# EAGLE design Zio Eink Display Red 2.9 (EAGLE 8.6.1)
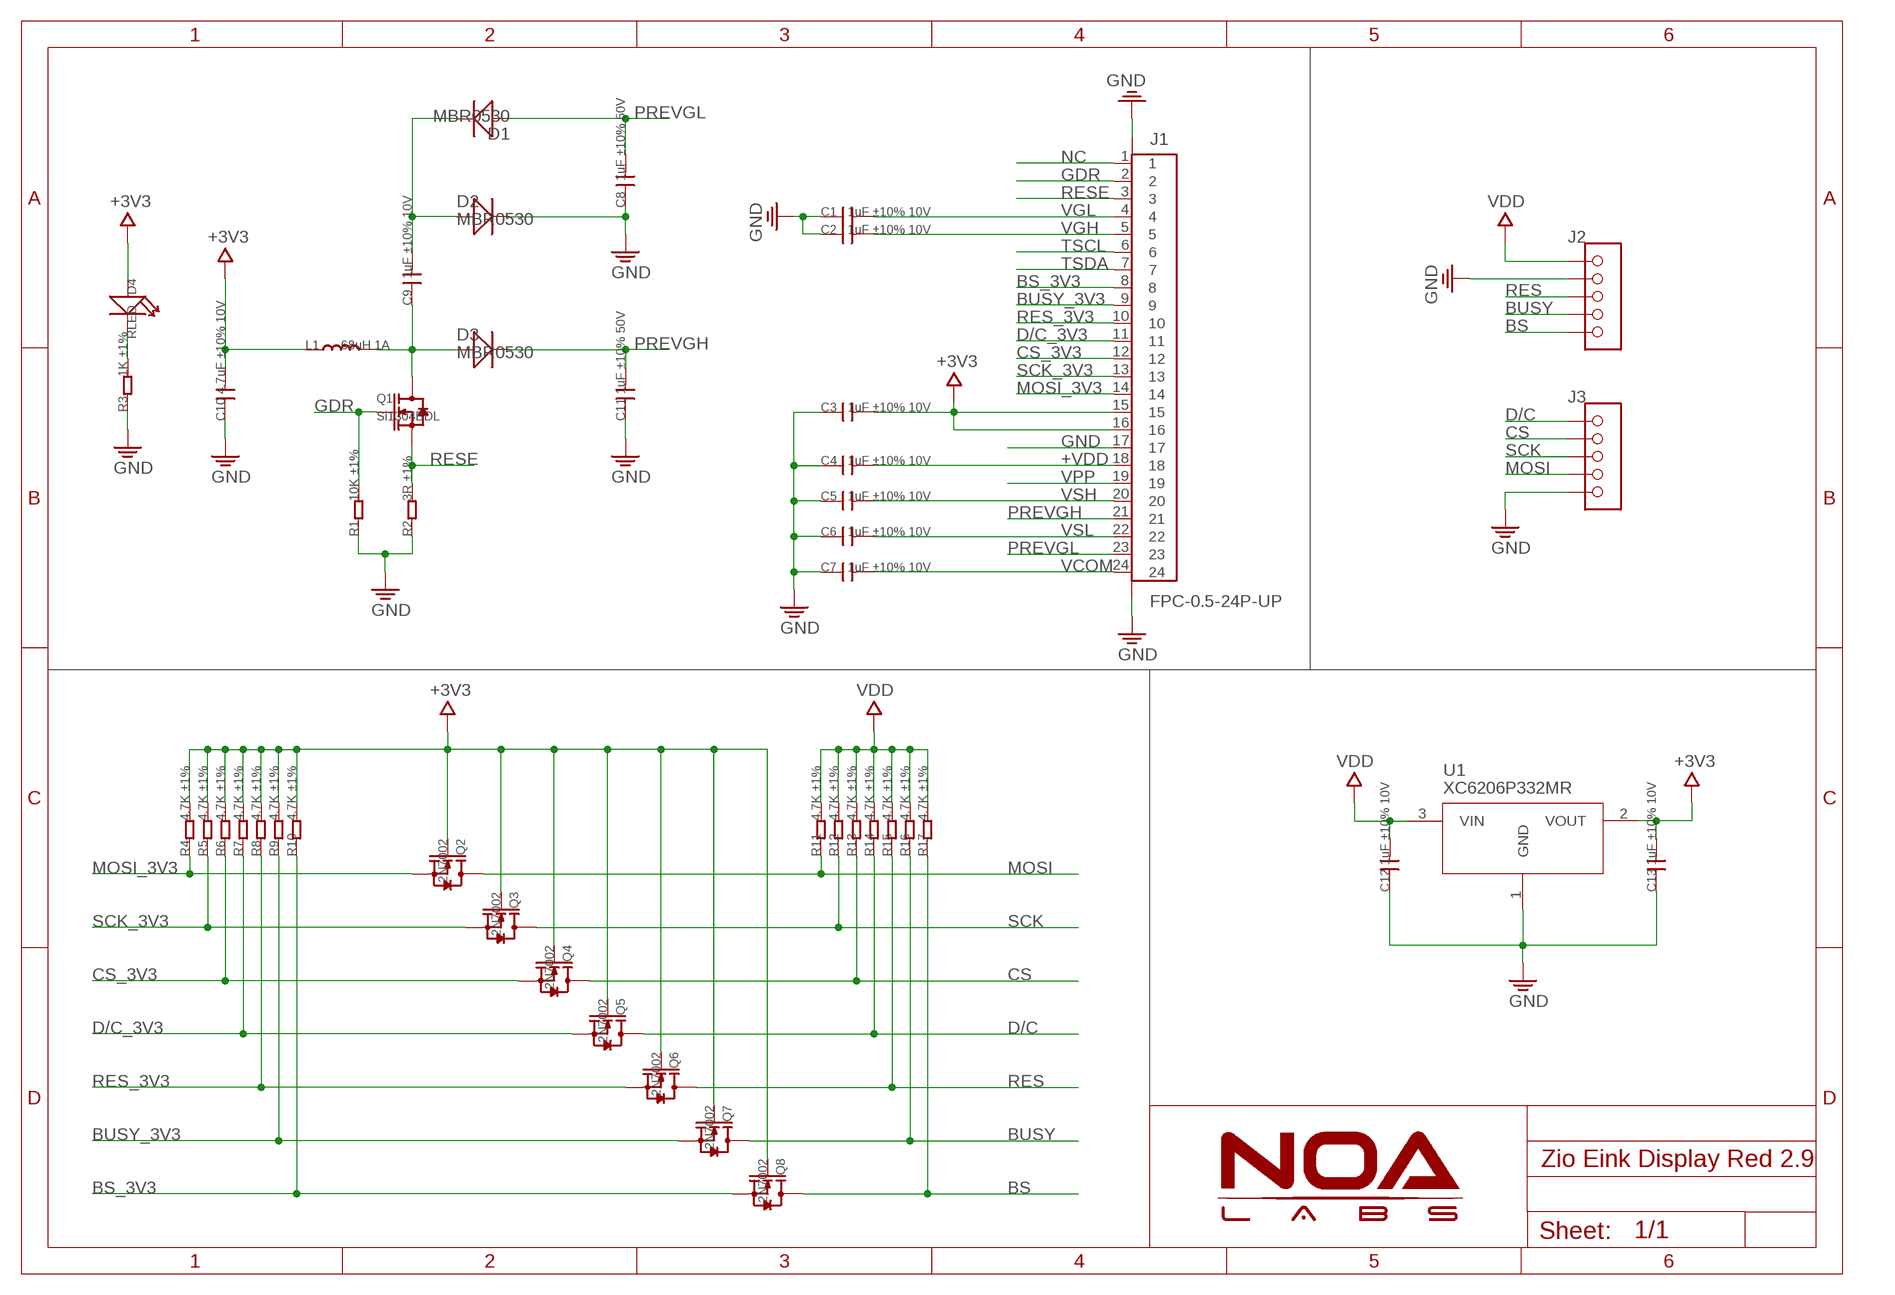
[diagram p0: schematic, sheet 1]

## Parts
C1  1uF ±10% 10V  C-0603  [0603]
C2  1uF ±10% 10V  C-0603  [0603]
C3  1uF ±10% 10V  C-0603  [0603]
C4  1uF ±10% 10V  C-0603  [0603]
C5  1uF ±10% 10V  C-0603  [0603]
C6  1uF ±10% 10V  C-0603  [0603]
C7  1uF ±10% 10V  C-0603  [0603]
C8  1uF ±10% 50V  C-0603  [0603]
C9  1uF ±10% 10V  C-0603  [0603]
C10  4.7uF ±10% 10V  C-0603  [0603]
C11  1uF ±10% 50V  C-0603  [0603]
C12  1uF ±10% 10V  C-0603  [0603]
C13  1uF ±10% 10V  C-0603  [0603]
D1  MBR0530  D'1206'  [SOD123]
D2  MBR0530  D'1206'  [SOD123]
D3  MBR0530  D'1206'  [SOD123]
D4  RLED  LED'0603'  [LED-0603]
J1  FPC-0.5-24P-UP  [FPC-0.5-24P_UP]
J2  HEADER-5P-2.54  [5P-2.54]
J3  HEADER-5P-2.54  [5P-2.54]
L1  68uH 1A  L  [L3012]
Q1  Si1304BDL  MOSFET-N-323  [SOT-323]
Q2  2N7002  MOSFET-N-SOT23  [SOT23]
Q3  2N7002  MOSFET-N-SOT23  [SOT23]
Q4  2N7002  MOSFET-N-SOT23  [SOT23]
Q5  2N7002  MOSFET-N-SOT23  [SOT23]
Q6  2N7002  MOSFET-N-SOT23  [SOT23]
Q7  2N7002  MOSFET-N-SOT23  [SOT23]
Q8  2N7002  MOSFET-N-SOT23  [SOT23]
R1  10K ±1%  R-0603  [0603]
R2  3R ±1%  R-0603  [0603]
R3  1K ±1%  R-0603  [0603]
R4  4.7K ±1%  R-0603  [0603]
R5  4.7K ±1%  R-0603  [0603]
R6  4.7K ±1%  R-0603  [0603]
R7  4.7K ±1%  R-0603  [0603]
R8  4.7K ±1%  R-0603  [0603]
R9  4.7K ±1%  R-0603  [0603]
R10  4.7K ±1%  R-0603  [0603]
R11  4.7K ±1%  R-0603  [0603]
R12  4.7K ±1%  R-0603  [0603]
R13  4.7K ±1%  R-0603  [0603]
R14  4.7K ±1%  R-0603  [0603]
R15  4.7K ±1%  R-0603  [0603]
R16  4.7K ±1%  R-0603  [0603]
R17  4.7K ±1%  R-0603  [0603]
U1  XC6206P332MR  XC6206MR  [SOT23]

## Nets
+3V3: C3.2 C10.2 C13.2 D4.+ J1.15 J1.16 L1.P$1 Q2.1(G) Q3.1(G) Q4.1(G) Q5.1(G) Q6.1(G) Q7.1(G) Q8.1(G) R4.2 R5.2 R6.2 R7.2 R8.2 R9.2 R10.2 U1.2(VOUT)
+VDD: C4.2 J1.18
BS: J2.5 Q8.3(D) R17.1
BS_3V3: J1.8 Q8.2(S) R10.1
BUSY: J2.4 Q7.3(D) R16.1
BUSY_3V3: J1.9 Q7.2(S) R9.1
CS: J3.2 Q4.3(D) R13.1
CS_3V3: J1.12 Q4.2(S) R6.1
D/C: J3.1 Q5.3(D) R14.1
D/C_3V3: J1.11 Q5.2(S) R7.1
GDR: J1.2 Q1.1(G) R1.2
GND: C1.1 C2.1 C3.1 C4.1 C5.1 C6.1 C7.1 C8.1 C10.1 C11.1 C12.1 C13.1 D2.- J1.17 J1.25(G1) J1.26(G2) J2.2 J3.5 R1.1 R2.1 R3.1 U1.1(GND)
MOSI: J3.4 Q2.3(D) R11.1
MOSI_3V3: J1.14 Q2.2(S) R4.1
N$2: C9.2 D1.- D2.+
N$3: C9.1 D3.+ L1.P$2 Q1.3(D)
N$7: D4.- R3.2
NC: J1.1
PREVGH: C11.2 D3.- J1.21
PREVGL: C8.2 D1.+ J1.23
RES: J2.3 Q6.3(D) R15.1
RES_3V3: J1.10 Q6.2(S) R8.1
RESE: J1.3 Q1.2(S) R2.2
SCK: J3.3 Q3.3(D) R12.1
SCK_3V3: J1.13 Q3.2(S) R5.1
TSCL: J1.6
TSDA: J1.7
VCOM: C7.2 J1.24
VDD: C12.2 J2.1 R11.2 R12.2 R13.2 R14.2 R15.2 R16.2 R17.2 U1.3(VIN)
VGH: C2.2 J1.5
VGL: C1.2 J1.4
VPP: J1.19
VSH: C5.2 J1.20
VSL: C6.2 J1.22

## Library data of the parts
C1-C13 = Discretex:C*: Ceramic Capacitors
D1-D3 = Discretex:D*
D4 = Discretex:LED*
J1 = Connector:FPC-0.5-24P
J2 J3 = Connector:HEADER-5P
L1 = Discretex:L*
Q1-Q8 = Discretex:MOSFET-N
R1-R17 = Discretex:R*
U1 = IC:XC6206MR

## Board
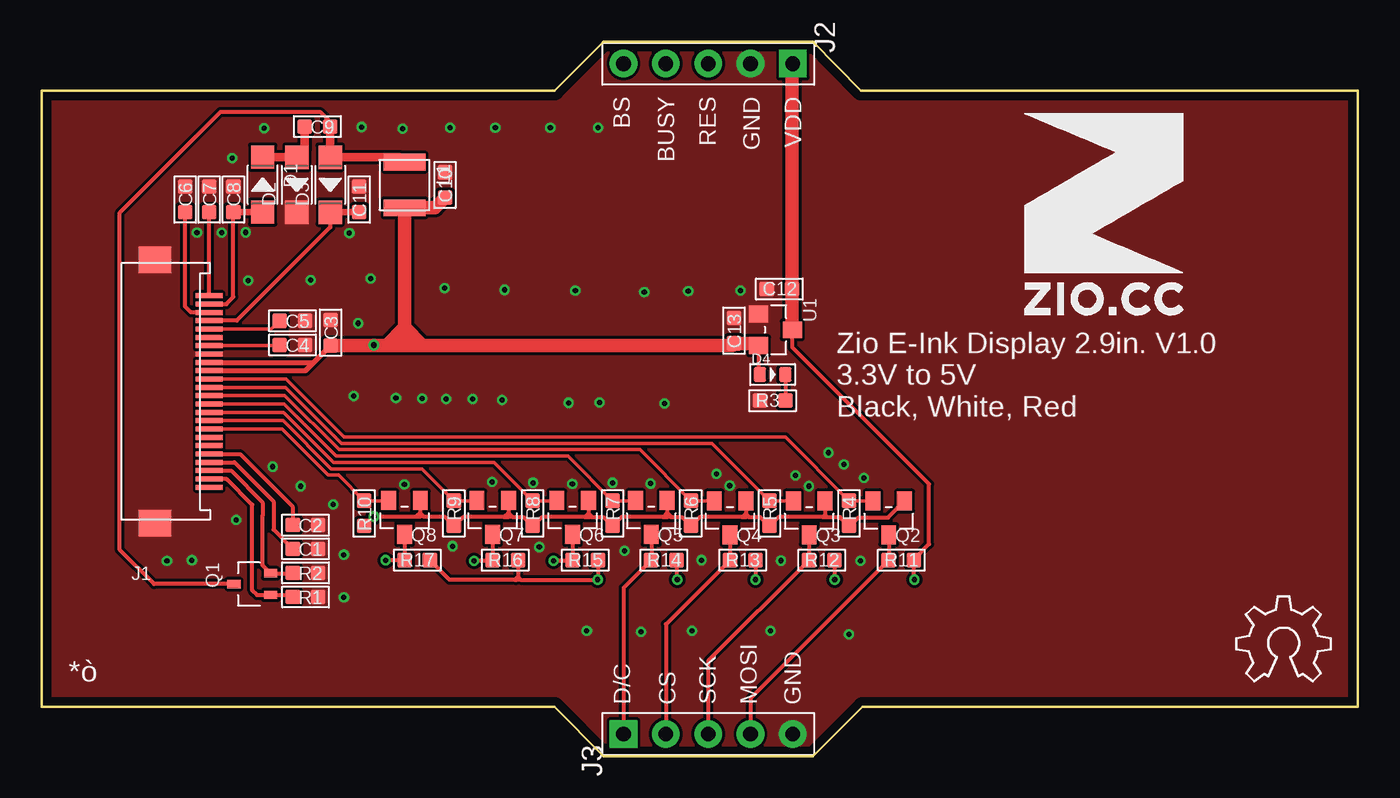
[diagram p1: board, top side]
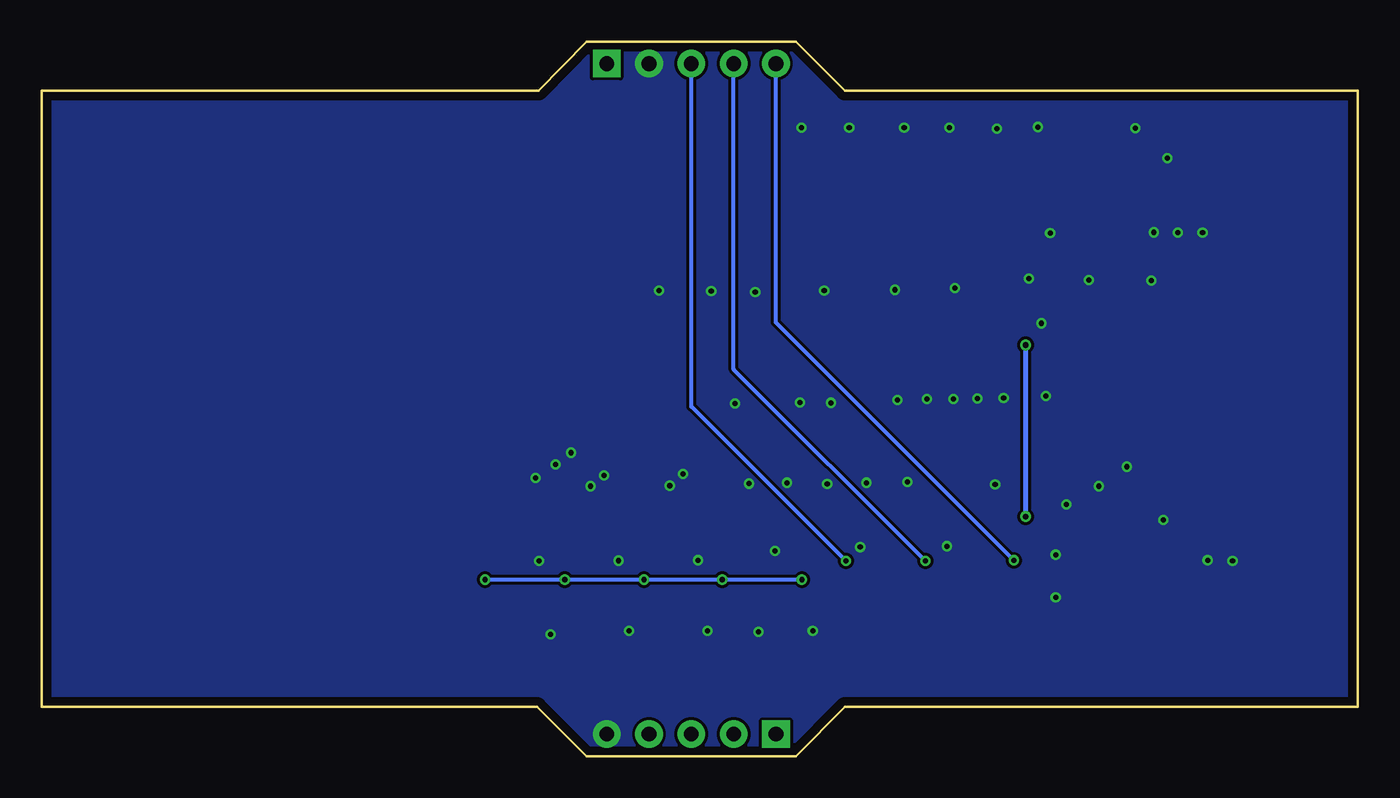
[diagram p2: board, bottom side, seen from below]

Size 79 x 42.89 mm. Coordinates in mm from the lower left corner, seen from the top.
Outline: 0,2.95 30.79,2.95 33.73,0 46.3,0 49.25,2.95 79,2.95 79,39.95 49.17,39.95 46.3,42.89 33.73,42.89 30.79,39.95 0,39.95 0,2.95
Copper layers (1*16): Top 0.035mm / dielectric 1.5mm / Bottom 0.035mm
Design rules "NOA Eagle Rule": minimum track width 7mil, minimum drill 12mil, track to track 7mil, track to pad 7mil, pad to pad 7mil, via to via 7mil, smd to smd 0mil, copper to edge 20mil, drill to drill 10mil, minimum pad ring 10mil, minimum via ring 6mil, stop-mask expansion 2mil, vias tented up to drill 25mil, thermal gap 10mil

### Footprints (pad centres in the part's own frame; a part is rotated, then mirrored left to right if it is on the bottom)
0603 = smd 0.889 x 0.889: 1 -0.762,0; 2 0.762,0
SOD123 = smd 1.397 x 1.397: + 1.651,0; - -1.651,0
LED-0603 = smd 0.762 x 0.889: + -0.762,0; - 0.762,0
FPC-0.5-24P_UP = smd 0.3 x 1.6: 1 -5.75,-0.05; 2 -5.25,-0.05; 3 -4.75,-0.05; 4 -4.25,-0.05; 5 -3.75,-0.05; 6 -3.25,-0.05; 7 -2.75,-0.05; 8 -2.25,-0.05; 9 -1.75,-0.05; 10 -1.25,-0.05; 11 -0.75,-0.05; 12 -0.25,-0.05; 13 0.25,-0.05; 14 0.75,-0.05; 15 1.25,-0.05; 16 1.75,-0.05; 17 2.25,-0.05; 18 2.75,-0.05; 19 3.25,-0.05; 20 3.75,-0.05; 21 4.25,-0.05; 22 4.75,-0.05; 23 5.25,-0.05; 24 5.75,-0.05 | smd 1.6 x 1.95: 25 7.9,3.2; 26 -7.9,3.2
5P-2.54 = drill 0.889 pad 1.651 square: 1 0,5.08 | drill 0.889 pad 1.651: 2 0,2.54; 3 0,0; 4 0,-2.54; 5 0,-5.08
L3012 = smd 2.5 x 1: P$1 0,1.373; P$2 0,-1.373
SOT-323 = smd 0.5 x 0.8: 1 0.65,0; 2 -0.65,0; 3 0,-2.2
SOT23 = smd 0.889 x 1.143: 1 -0.95,-1.016; 2 0.95,-1.016; 3 0,1.016
SOT23' = smd 1.016 x 1.143: 1 -0.95,-1.016; 2 0.95,-1.016; 3 0,1.016

### Placement (x,y rotation side)
C1  15.84,12.44 180 top
C2  15.84,13.87 180 top
C3  17.35,25.42 270 top
C4  15.05,24.69 180 top
C5  15.05,26.14 180 top
C6  8.61,33.42 270 top
C7  10.06,33.42 270 top
C8  11.51,33.42 270 top
C9  16.55,37.79 180 top
C10  24.21,34.28 270 top
C11  19.05,33.42 270 top
C12  44.28,28.04 0 top
C13  41.56,25.54 270 top
D1  13.26,34.31 270 top
D2  15.31,34.3 90 top
D3  17.32,34.3 90 top
D4  43.88,22.91 0 top
J1  10,21.89 90 top
J2  40.01,41.57 270 top
J3  40.01,1.32 90 top
L1  21.78,34.29 180 top
Q1  13.74,10.33 270 top
Q2  50.84,14.3 180 top
Q3  46.07,14.3 180 top
Q4  41.32,14.3 180 top
Q5  36.59,14.32 180 top
Q6  31.87,14.32 180 top
Q7  27.07,14.32 180 top
Q8  21.78,14.32 180 top
R1  15.84,9.55 180 top
R2  15.84,11 180 top
R3  43.88,21.34 0 top
R4  48.46,14.57 270 top
R5  43.69,14.57 270 top
R6  38.96,14.57 270 top
R7  34.27,14.57 270 top
R8  29.47,14.57 270 top
R9  24.74,14.57 270 top
R10  19.36,14.57 270 top
R11  51.6,11.76 0 top
R12  46.82,11.76 0 top
R13  42.07,11.76 0 top
R14  37.35,11.76 0 top
R15  32.62,11.76 0 top
R16  27.82,11.76 0 top
R17  22.54,11.76 0 top
U1  XC6206P332MR  [SOT23']  44.04,25.59 270 top
U$9  [12MM]  58.88,26.42 0 top
U$10  [OSHW_6X200_NOTEXT]  71.7,4.5 0 top

### Tracks (layer width: path | path; a pad name or v marks a point on that pad's centre or on a via)
+3V3  (via drill 0.35)
  Top 0.254: 22.48,14.38 22.71,14.38 | 22.48,14.38 v19.94,14.38 19.93,14.38 R10.2 | 22.94,14.38 22.71,14.38 | 22.94,14.38 24.17,14.38 R9.2 24.75,13.81 25.3,14.35 27.76,14.35 | 27.76,14.35 28.02,14.35 | 28.27,14.35 28.02,14.35 | 28.27,14.35 28.92,14.35 R8.2 29.5,13.81 30.05,14.35 32.61,14.35 | 32.61,14.35 32.87,14.35 | 33.02,14.35 32.87,14.35 | 33.02,14.35 33.72,14.35 R7.2 34.8,14.35 37.31,14.35 | 37.31,14.35 37.54,14.35 | 37.8,14.35 37.54,14.35 | 37.8,14.35 38.42,14.35 R6.2 39.51,14.35 42.06,14.35 | 42.06,14.35 42.27,14.35 | 42.44,14.35 42.27,14.35 | 42.44,14.35 43.13,14.35 43.67,13.81 R5.2 44.23,14.35 46.89,14.35 | 46.89,14.35 47.02,14.35 | 47.14,14.35 47.02,14.35 | 47.14,14.35 47.93,14.35 47.93,14.34 R4.2 48.5,13.81 49.02,14.33 50.8,14.33 Q2.1 51.79,15.49 | Q3.1 47.02,14.48 | 47.02,14.48 47.02,14.35 | 47.02,14.48 46.89,14.35 | 47.02,14.48 | 47.02,14.48 47.14,14.35 | Q4.1 42.27,14.55 | 42.27,14.53 42.27,14.35 | 42.27,14.35 | 42.27,14.55 42.06,14.35 | 42.27,14.55 42.27,14.53 | 42.27,14.53 42.44,14.35 | Q5.1 37.54,14.55 | 37.54,14.55 37.54,14.35 | 37.54,14.35 | 37.54,14.55 37.52,14.55 37.31,14.35 | 37.54,14.55 37.59,14.55 37.8,14.35 | Q6.1 32.82,14.55 | 32.82,14.55 32.82,14.4 32.87,14.35 | 32.82,14.55 32.61,14.35 | 32.82,14.55 33.02,14.35 | Q7.1 | Q7.1 28.02,14.61 | 28.02,14.61 28.02,14.35 | 28.02,14.61 27.76,14.35 | 28.02,14.61 28.27,14.35 | Q8.1 22.71,15.31 22.71,14.61 | 22.71,14.61 22.71,14.38 | 22.71,14.61 22.48,14.38 | 22.71,14.61 22.94,14.38 | U1.2 43.03,23 D4.+ | 41.63,24.7 C13.2
  Top 0.305: v19.94,24.68 20.67,24.68 20.69,24.65 | C3.2 16.33,23.64 | J1.16 16.33,23.64 | J1.15 15.83,23.14 16.33,23.64
  Top 0.813: C10.2 23.61,32.92 L1.P$1 21.78,25.75 | U1.2 42.89,24.78 C13.2 41.43,24.65 22.88,24.65 | 20.69,24.65 21.78,25.75 | C3.2 20.69,24.65 | 22.88,24.65 21.95,24.65 | 21.95,24.65 20.69,24.65 | 21.78,25.75 21.78,24.82 21.95,24.65 | 21.78,25.75 22.88,24.65
  Bottom 0.305: v19.94,14.38 v19.94,24.68
+VDD
  Top 0.203: C4.2 14.24,24.64 J1.18
BS  (via drill 0.3)
  Top 0.254: Q8.3 R17.1 v20.65,11.76
  Bottom 0.254: v20.65,11.76 34.92,26.04 J2.5
BS_3V3
  Top 0.203: Q8.2 R10.1 17.82,16.87 17.21,16.87 14.44,19.64 J1.8
BUSY  (via drill 0.3)
  Top 0.254: Q7.3 R16.1 27.01,11.71 v25.96,11.71
  Bottom 0.254: v25.96,11.71 37.47,23.22 J2.4
BUSY_3V3
  Top 0.203: Q7.2 26.11,15.33 R9.1 22.82,17.25 17.37,17.25 14.48,20.14 J1.9
CS
  Top 0.254: Q4.3 R13.1 37.47,7.92 J3.2
CS_3V3
  Top 0.203: Q4.2 40.35,15.33 R6.1 35.9,18.39 17.84,18.39 14.6,21.64 J1.12
D/C
  Top 0.254: Q5.3 R14.1 34.92,10.1 J3.1
D/C_3V3
  Top 0.203: Q5.2 R7.1 31.58,18.01 17.68,18.01 14.56,21.14 J1.11
GDR
  Top 0.254: R1.2 14.95,9.68 Q1.1 12.93,9.68 12.65,9.96 12.65,15.09 11.1,16.64 J1.2
GND  (via drill 0.3)
  other vias: 39.6,11.76 44.37,11.73 49.15,11.71 27.03,16.46 31.85,16.33 36.55,16.36 41.3,16.23 46.05,16.21 49.35,16.69 10.79,31.42 11.43,35.89 48.16,17.5 47.22,18.21 45.24,16.84 40.51,16.94 34.26,16.41 29.49,16.41 21.77,16.31 12.24,31.45 9.32,31.42 18.47,31.39 19,25.98 18.72,21.62 9.02,11.76 11.68,14.17 21.26,21.49 22.83,21.46 24.28,21.44 25.86,21.44 27.64,21.39 31.62,21.21 33.48,21.23 37.39,21.16 24.18,28.09 27.79,27.99 32.03,27.94 36.17,27.86 38.81,27.91 41.94,27.94 12.4,28.55 16.15,28.57 19.74,28.68 13.36,37.69 19.2,37.77 21.67,37.67 24.51,37.72 27.23,37.72 30.53,37.72 33.4,37.72 7.52,11.71 13.87,17.37 15.54,16.21 17.5,15.11 18.14,12.09 18.14,9.53 32.72,7.52 35.97,7.47 39.04,7.52 43.74,7.52 48.46,7.32 34.98,12.32 29.87,12.55 24.66,12.6
  pour Bottom (no thermals): 0,0 0,42.8 78.97,42.8 78.97,0
  pour Top (no thermals): 0,0 78.97,0 78.97,42.8 0,42.8
MOSI
  Top 0.254: Q2.3 R11.1 42.55,3.47 J3.4
MOSI_3V3
  Top 0.203: Q2.2 49.87,15.33 R4.1 44.64,19.16 18.16,19.16 14.68,22.64 J1.14
N$2
  Top 0.508: D1.- D2.+ 15.79,36.42 C9.2
N$3
  Top 0.254: Q1.3 6.74,10.33 4.7,12.37 4.7,32.64 10.74,38.68 16.71,38.68 17.32,38.08 17.32,37.78
  Top 0.508: C9.1 17.32,37.78 D3.+ 21.49,35.95 L1.P$2
N$7
  Top 0.254: D4.- R3.2
PREVGH
  Top 0.254: D3.- 17.32,31.75 11.71,26.14 J1.21 | C11.2
  Top 0.381: D3.- C11.2
PREVGL
  Top 0.254: C8.2 11.51,27.56 11.08,27.14 J1.23
  Top 0.381: C8.2 D1.+
RES  (via drill 0.3)
  Top 0.254: Q6.3 R15.1 31.81,11.71 v30.73,11.71
  Bottom 0.254: v30.73,11.71 40.01,20.98 J2.3
RES_3V3
  Top 0.203: Q6.2 30.91,15.33 R8.1 27.16,17.63 17.52,17.63 14.52,20.64 J1.10
RESE
  Top 0.254: R2.2 15.06,10.98 Q1.2 13.26,11.46 13.26,14.22 13.26,14.43 13.26,15.24 11.36,17.14 J1.3
SCK
  Top 0.254: Q3.3 R12.1 40.01,5.71 J3.3
SCK_3V3
  Top 0.203: Q3.2 45.1,15.33 R5.1 40.24,18.77 18,18.77 14.64,22.14 J1.13
VCOM
  Top 0.254: C7.2 J1.24
VDD  (via drill 0.3)
  Top 0.254: R17.2 24.47,10.59 28.4,10.59 | 28.75,10.59 28.52,10.59 | 28.75,10.59 v33.38,10.59 33.39,10.6 R15.2 | 28.4,10.59 28.52,10.59 | v52.38,10.59 52.36,10.61 R11.2 52.36,11.82 53.26,12.72 53.26,16.33 45.06,24.54 U1.3 | R12.2 47.6,11.75 v47.6,10.59 | R13.2 42.83,10.61 v42.85,10.59 | R14.2 38.11,10.63 v38.15,10.59 | R16.2 28.59,10.78 | 28.59,10.76 28.59,10.65 28.52,10.59 | 28.59,10.78 28.4,10.59 | 28.59,10.78 28.59,10.76 | 28.59,10.76 28.75,10.59
  Top 0.813: U1.3 45.04,25.61 C12.2 45.04,41.53 J2.1
  Bottom 0.254: v33.38,10.59 v38.15,10.59 v42.85,10.59 v47.6,10.59 v52.38,10.59
VGH
  Top 0.203: 15.05,13.89 C2.2
  Top 0.254: J1.5 11.91,18.14 15.05,15 15.05,13.89
VGL
  Top 0.203: C1.2 | 13.92,13.6 13.92,14.49
  Top 0.254: J1.4 11.57,17.64 13.92,15.29 13.92,13.6 C1.2
VSH
  Top 0.203: C5.2 13.79,25.64 J1.20
VSL
  Top 0.254: C6.2 8.61,27 8.97,26.64 J1.22

### Text on the board
tPlace: BS | BUSY | RES | GND | VDD | Zio E-Ink Display 2.9in. V1.0 / 3.3V to 5V / Black, White, Red | *ò | D/C | CS | SCK | MOSI | GND